# Altium schematic sheet gpio_tcal9539_expander.SchDoc
size A
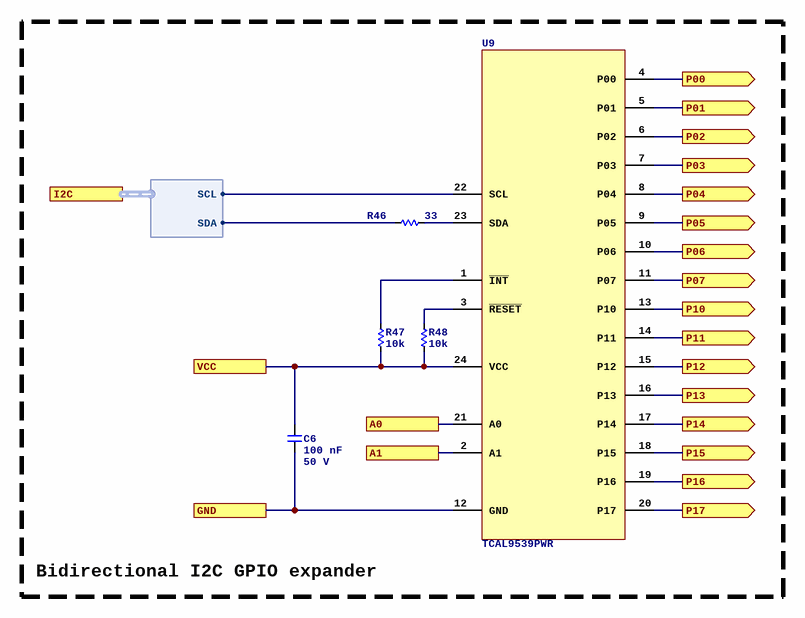
[diagram p0: gpio_tcal9539_expander.SchDoc]

## Parts
C6  Capacitance: 100 nF  Voltage Rating: 50 V  [C0402]  (hidden comment: CL05B104KB54PNC)
R46  value 33  [R0402]  (hidden comment: CRCW040233R0FKED)
R47  value 10k  [R0402]  (hidden comment: 0402WGF1002TCE)
R48  value 10k  [R0402]  (hidden comment: 0402WGF1002TCE)
U9  TCAL9539PWR  [24TSSOP65]

## Blocks framed on the sheet
Bidirectional I2C GPIO expander: C6 R46-R48 U9

## Ports
A0, A1, GND, I2C (harness I2C), P00 (out), P01 (out), P02 (out), P03 (out), P04 (out), P05 (out), P06 (out), P07 (out), P10 (out), P11 (out), P12 (out), P13 (out), P14 (out), P15 (out), P16 (out), P17 (out), VCC

## Harnesses
I2C: SCL, SDA

## Nets
A0: U9.21(A0) ; port A0
A1: U9.2(A1) ; port A1
GND: C6.2 U9.12(GND) ; port GND
P00: U9.4(P00) ; port P00
P01: U9.5(P01) ; port P01
P02: U9.6(P02) ; port P02
P03: U9.7(P03) ; port P03
P04: U9.8(P04) ; port P04
P05: U9.9(P05) ; port P05
P06: U9.10(P06) ; port P06
P07: U9.11(P07) ; port P07
P10: U9.13(P10) ; port P10
P11: U9.14(P11) ; port P11
P12: U9.15(P12) ; port P12
P13: U9.16(P13) ; port P13
P14: U9.17(P14) ; port P14
P15: U9.18(P15) ; port P15
P16: U9.19(P16) ; port P16
P17: U9.20(P17) ; port P17
VCC: C6.1 R47.1 R48.1 U9.24(VCC) ; port VCC
NetR46_1: R46.1 U9.23(SDA)
NetR46_2: R46.2 ; port I2C.SDA
NetR47_2: R47.2 U9.1(~{INT})
NetR48_2: R48.2 U9.3(~{RESET})
NetU9_22: U9.22(SCL) ; port I2C.SCL

## Library data of the parts
C6 = CL05B104KB54PNC: Manufacturer: Samsung Electro-Mechanics; Dielectric: X7R; ComponentLink1URL: https://wmsc.lcsc.com/wmsc/upload/file/pdf/v2/lcsc/2304140030_Samsung-Electro-Mechanics-CL05B104KB54PNC_C307331.pdf; ComponentLink1Description: Datasheet; Manufacturer Part Number: CL05B104KB54PNC; Package: 0402; Supplier 2: LCSC; Supplier Part Number 2: C307331
R46 = CRCW040233R0FKED: Manufacturer: Vishay Intertech; Tolerance: 1%; Temperature Coefficient: Â±100ppm/â„ƒ; Power Rating (mW): 63; ComponentLink1Description: Datasheet; ComponentLink1URL: https://wmsc.lcsc.com/wmsc/upload/file/pdf/v2/lcsc/2304140030_Vishay-Intertech-CRCW040233R0FKED_C242490.pdf; Manufacturer Part Number: CRCW040233R0FKED; Package: 0402; Supplier 2: LCSC; Supplier Part Number 2: C242490
R47 R48 = 0402WGF1002TCE: Manufacturer: UNI-ROYAL(Uniroyal Elec); Tolerance: 1%; Temperature Coefficient: Â±100ppm/â„ƒ; Power Rating (mW): 62.5; ComponentLink1Description: Datasheet; ComponentLink1URL: https://wmsc.lcsc.com/wmsc/upload/file/pdf/v2/lcsc/2206010100_UNI-ROYAL-Uniroyal-Elec-0402WGF1002TCE_C25744.pdf; Manufacturer Part Number: 0402WGF1002TCE; Package: 0402; Supplier 2: LCSC; Supplier Part Number 2: C25744
U9 = TCAL9539PWR: I/O Expander 16 I2C, SMBus 1 MHz 24-TSSOP; Manufacturer: Texas Instruments; Manufacturer Part Number: TCAL9539PWR; Supplier 1: DigiKey; Supplier 2: LCSC; Supplier Part Number 1: 296-TCAL9539PWRCT-ND; Supplier Part Number 2: C22445412; Supplier 3: Mouser; Supplier Part Number 3: 595-TCAL9539PWR; ComponentLink1Description: Datasheet; ComponentLink1URL: https://www.ti.com/lit/gpn/TCAL9539